# Altium schematic sheet VS1005BOB-Pico-LCD_2024-02-10.schdoc
size 572 x 342 mm
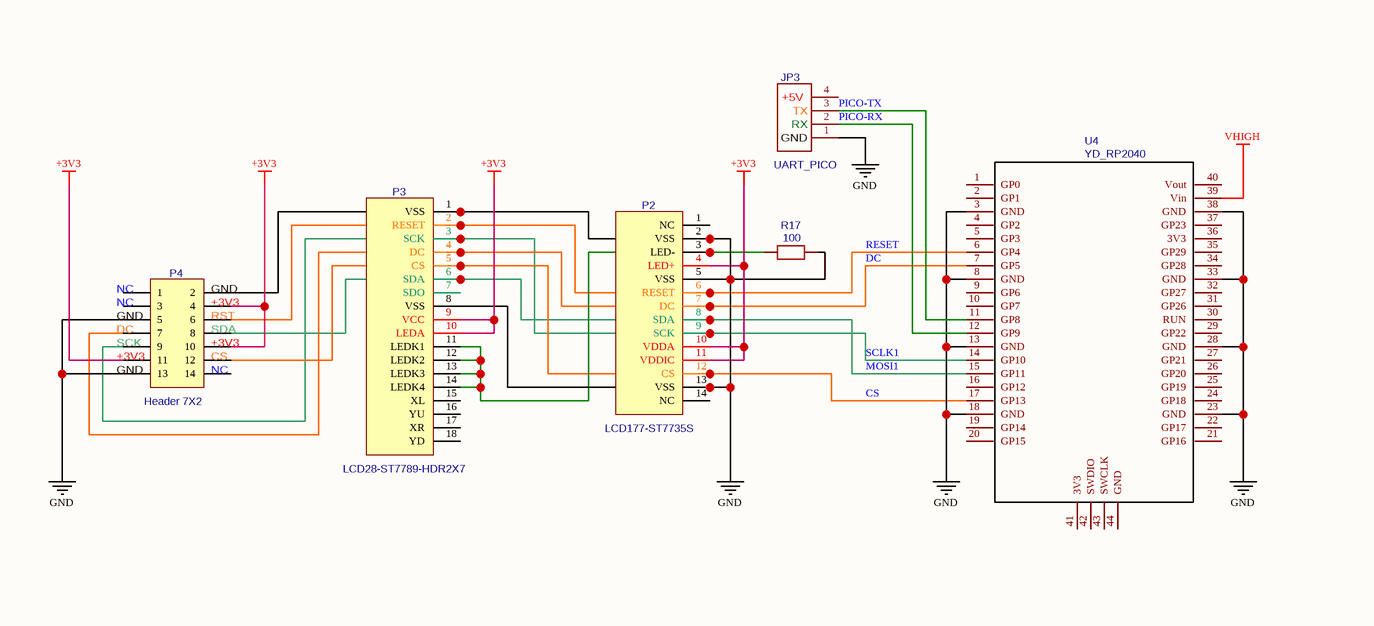
[diagram p0: VS1005BOB-Pico-LCD_2024-02-10.schdoc, left]
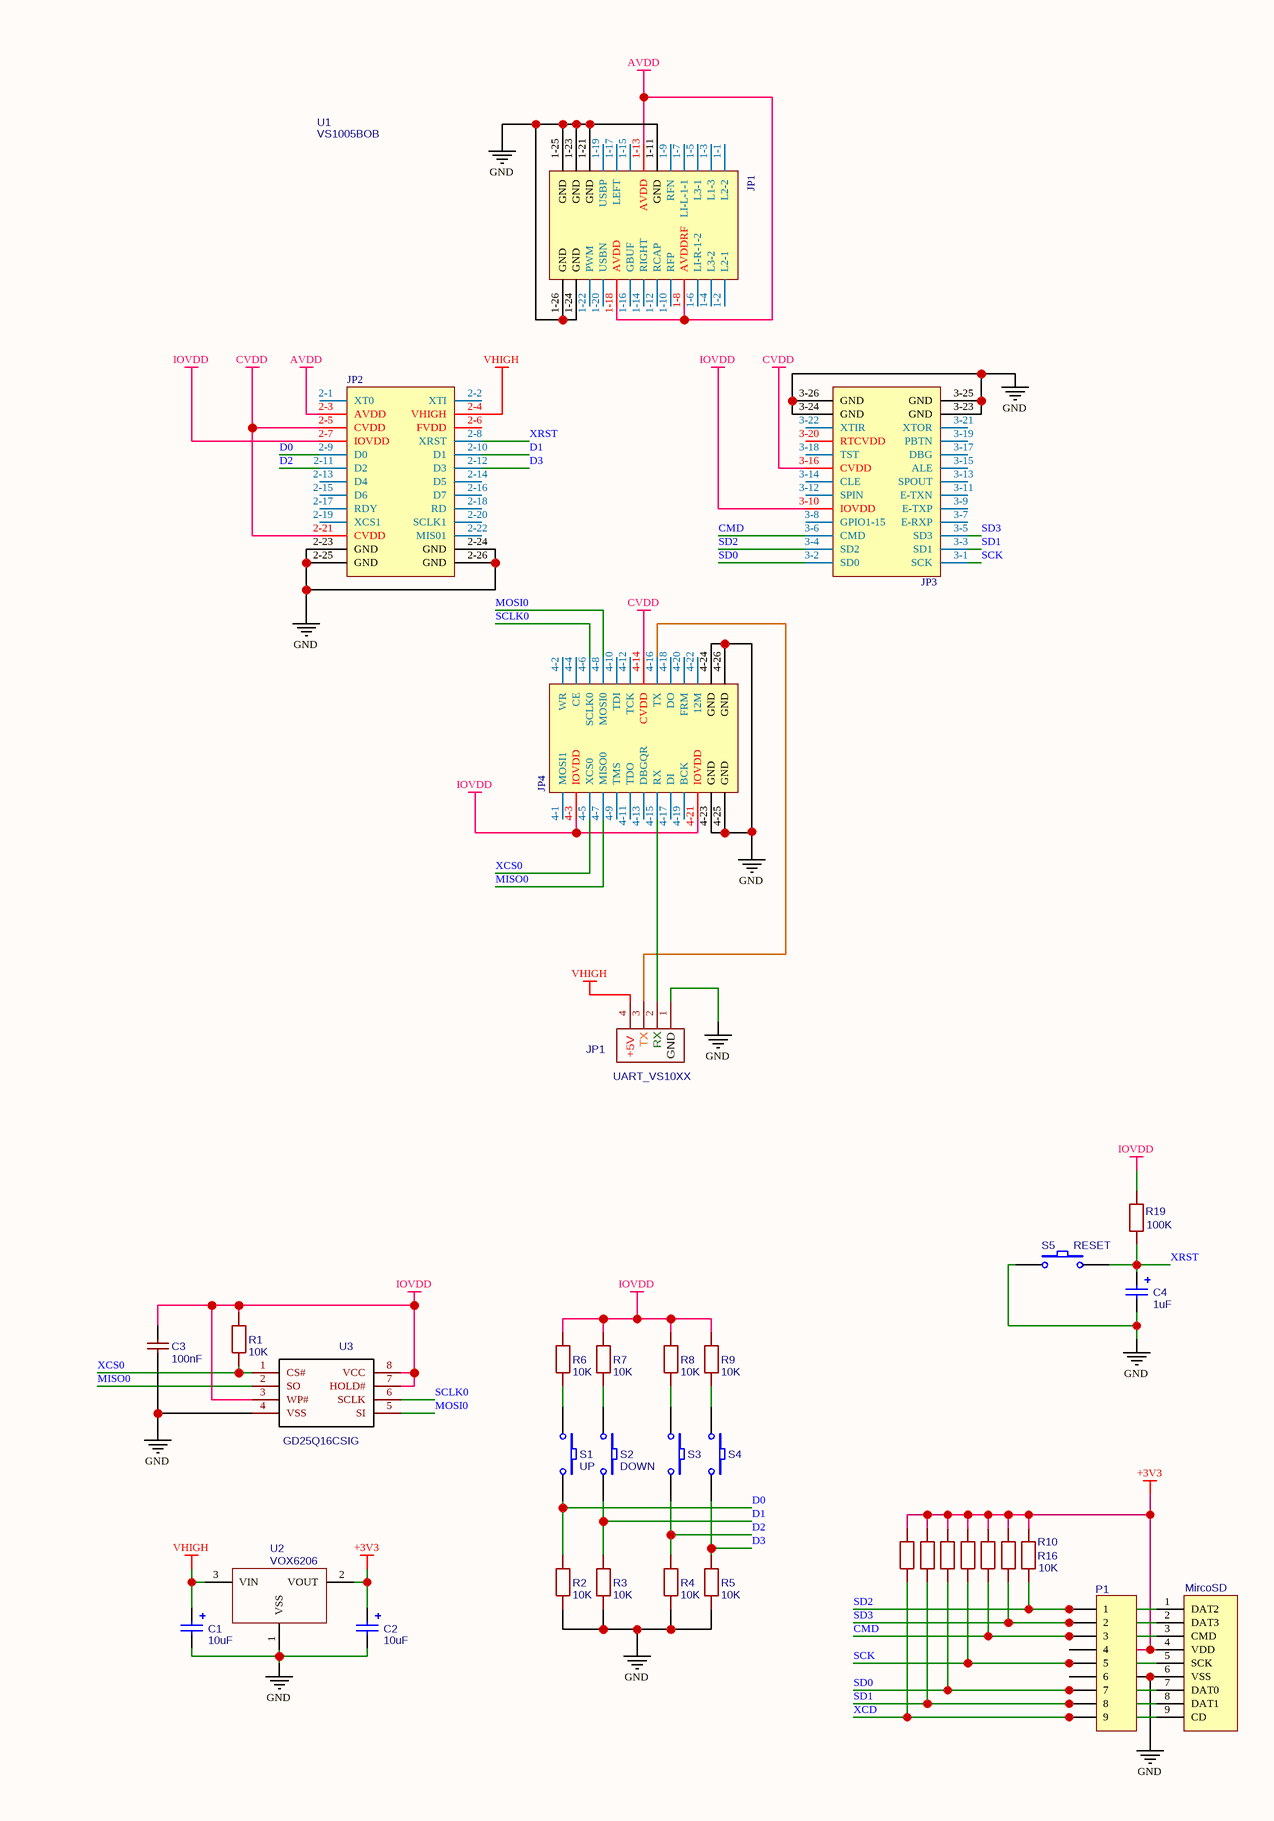
[diagram p1: VS1005BOB-Pico-LCD_2024-02-10.schdoc, right]

## Parts
C1  10uF  [CAP-DIP]
C2  10uF  [CAP-DIP]
C3  100nF  [CAP-0805]
C4  1uF  [CAP-DIP]
JP1  UART_VS10XX  [HDR1X4]
JP3  UART_PICO  [HDR1X4]
P1  Header 9  [HDR1X9]  (value not drawn)
P2  LCD177-ST7735S  [LCD177-ST7735S]
P3  LCD28-ST7789-HDR2X7  [FPC18]
P4  Header 7X2  [HDR2X7]
P6  MircoSD  [MICROSD]
R1  10K  [RES-0805]
R2  10K  [RES-0805]
R3  10K  [RES-0805]
R4  10K  [RES-0805]
R5  10K  [RES-0805]
R6  10K  [RES-0805]
R7  10K  [RES-0805]
R8  10K  [RES-0805]
R9  10K  [RES-0805]
R10  10K  [RES-0805]  (value not drawn)
R11  10K  [RES-0805]  (value not drawn)
R12  10K  [RES-0805]  (value not drawn)
R13  10K  [RES-0805]  (value not drawn)
R14  10K  [RES-0805]  (value not drawn)
R15  10K  [RES-0805]  (value not drawn)
R16  10K  [RES-0805]
R17  100  [RES-0805]
R19  100K  [RES-0805]
S1  UP  [SW-4.5]
S2  DOWN  [SW-4.5]
S3  D2  [SW-4.5]  (value not drawn)
S4  D3  [SW-4.5]  (value not drawn)
S5  RESET  [SW-4.5]
U1  VS1005BOB  [VS1005BOB]
U2  VOX6206  [VOX6206]
U3  GD25Q16CSIG  [SOIC-8_L5.3-W5.3-P1.27-LS8.0-BL]
U4  YD_RP2040  [YD-RP2040]

## Nets
+3V3: C2.1 P1.4 P2.4(LED+) P2.10(VDDA) P2.11(VDDIC) P3.9(VCC) P3.10(LEDA) P4.4 P4.10 P4.11 P6.4(VDD) R10.2 R11.2 R12.2 R13.2 R14.2 R15.2 R16.2 U2.2(VOUT)
AVDD: U1.1-8(AVDDRF) U1.1-13(AVDD) U1.1-18(AVDD) U1.2-3(AVDD)
CVDD: U1.2-5(CVDD) U1.2-21(CVDD) U1.3-16(CVDD) U1.4-14(CVDD)
GND: C1.2 C2.2 C3.2 C4.2 JP1.1 JP3.1 P1.6 P2.2(VSS) P2.5(VSS) P2.13(VSS) P3.1(VSS) P3.8(VSS) P4.2 P4.5 P4.13 P6.6(VSS) R2.1 R3.1 R4.1 R5.1 R17.1 S5.1 U1.1-11(GND) U1.1-21(GND) U1.1-23(GND) U1.1-24(GND) U1.1-25(GND) U1.1-26(GND) U1.2-23(GND) U1.2-24(GND) U1.2-25(GND) U1.2-26(GND) U1.3-23(GND) U1.3-24(GND) U1.3-25(GND) U1.3-26(GND) U1.4-23(GND) U1.4-24(GND) U1.4-25(GND) U1.4-26(GND) U2.1(VSS) U3.4(VSS) U4.3(GND) U4.8(GND) U4.13(GND) U4.18(GND) U4.23(GND) U4.28(GND) U4.33(GND) U4.38(GND)
IOVDD: C3.1 R1.2 R6.2 R7.2 R8.2 R9.2 R19.2 U1.2-7(IOVDD) U1.3-10(IOVDD) U1.4-3(IOVDD) U1.4-21(IOVDD) U3.3(WP#) U3.7(HOLD#) U3.8(VCC)
VHIGH: C1.1 JP1.4 U1.2-4(VHIGH) U2.3(VIN) U4.39(Vin)
CMD: P1.3 P6.3(CMD) R14.1 U1.3-6(CMD)
CS: P2.12(CS) P3.5(CS) P4.12 U4.17(GP13)
D0: R2.2 S1.2 U1.2-9(D0)
D1: R3.2 S2.2 U1.2-10(D1)
D2: R4.2 S3.2 U1.2-11(D2)
D3: R5.2 S4.2 U1.2-12(D3)
DC: P2.7(DC) P3.4(DC) P4.7 U4.7(GP5)
MISO0: U1.4-7(MISO0) U3.2(SO)
MOSI0: U1.4-8(MOSI0) U3.5(SI)
MOSI1: P2.8(SDA) P3.6(SDA) P4.8 U4.15(GP11)
PICO-RX: JP3.2 U4.12(GP9)
PICO-TX: JP3.3 U4.11(GP8)
RESET: P2.6(RESET) P3.2(RESET) P4.6 U4.6(GP4)
SCK: P1.5 P6.5(SCK) R13.1 U1.3-1(SCK)
SCLK0: U1.4-6(SCLK0) U3.6(SCLK)
SCLK1: P2.9(SCK) P3.3(SCK) P4.9 U4.14(GP10)
SD0: P1.7 P6.7(DAT0) R12.1 U1.3-2(SD0)
SD1: P1.8 P6.8(DAT1) R11.1 U1.3-3(SD1)
SD2: P1.1 P6.1(DAT2) R16.1 U1.3-4(SD2)
SD3: P1.2 P6.2(DAT3) R15.1 U1.3-5(SD3)
XCD: P1.9 P6.9(CD) R10.1
XCS0: R1.1 U1.4-5(XCS0) U3.1(CS#)
XRST: C4.1 R19.1 S5.2 U1.2-8(XRST)
NetJP1_2: JP1.2 U1.4-15(RX)
NetJP1_3: JP1.3 U1.4-16(TX)
NetP2_3: P2.3(LED-) P3.11(LEDK1) P3.12(LEDK2) P3.13(LEDK3) P3.14(LEDK4) R17.2
NetR6_1: R6.1 S1.1
NetR7_1: R7.1 S2.1
NetR8_1: R8.1 S3.1
NetR9_1: R9.1 S4.1

Not connected (* = marked no-connect by the designer): JP3 4; P2 1(NC) 14(NC); P3 7(SDO) 15(XL) 16(YU) 17(XR) 18(YD); P4 1 3 14; U1 1-1(L2-2) 1-2(L2-1) 1-3(L1-3) 1-4(L3-2) 1-5(L3-1) 1-6(LI-R-1-2) 1-7(LI-L-1-1) 1-9(RFN) 1-10(RFP) 1-12(RCAP) 1-14(RIGHT) 1-15 1-16(GBUF) 1-17(LEFT) 1-19(USBP) 1-20(USBN) 1-22(PWM) 2-1(XT0) 2-2(XTI) 2-6(FVDD) 2-13(D4) 2-14(D5) 2-15(D6) 2-16(D7) 2-17(RDY) 2-18(RD) 2-19(XCS1) 2-20(SCLK1) 2-22(MIS01) 3-7(E-RXP) 3-8(GPIO1-15) 3-9(E-TXP) 3-11(E-TXN) 3-12(SPIN) 3-13(SPOUT) 3-14(CLE) 3-15(ALE) 3-17(DBG) 3-18(TST) 3-19(PBTN) 3-20(RTCVDD) 3-21(XTOR) 3-22(XTIR) 4-1(MOSI1) 4-2(WR) 4-4(CE) 4-9(TMS) 4-10(TDI) 4-11(TDO) 4-12(TCK) 4-13(DBGQR) 4-17(DI) 4-18(DO) 4-19(BCK) 4-20(FRM) 4-22(12M); U4 1(GP0) 2(GP1) 4(GP2) 5(GP3) 9(GP6) 10(GP7) 16(GP12) 19(GP14) 20(GP15) 21(GP16) 22(GP17) 24(GP18) 25(GP19) 26(GP20) 27(GP21) 29(GP22) 30(RUN) 31(GP26) 32(GP27) 34(GP28) 35(GP29) 36(3V3) 37(GP23) 40(Vout) 41(3V3) 42(SWDIO) 43(SWCLK) 44(GND)

## Notes on the sheet
- (near P4) NC
- (near P4) GND
- (near P4) DC
- (near P4) SCK
- (near P4) +3V3
- (near P4) RST
- (near P4) SDA
- (near P4) CS
- (in symbol UART_PICO) +5V; TX; RX; GND
- (in symbol UART_VS10XX) TX; RX; +5V; GND
- (in symbol VS1005BOB) JP1; JP2; JP3; JP4

## Library data of the parts
C1 C2 = 10uF: Contributor: kmok163; Published: 8-Jun-2000; LatestRevisionDate: 17-Jul-2002; LatestRevisionNote: Re-released for DXP Platform.; PackageReference: RAD-0.3; Publisher: Altium Limited; spicePre: C; spiceSymbolName: 10uF
C3 = 100nF: Manufacturer Part: CC0805KRX7R9BB104; Manufacturer: YAGEO; nameAlias: Capacitance; SMT Type: Basic; Contributor: fen-1; Supplier: LCSC; LCSC Assembly: Yes; Supplier Part: C49678; spicePre: C; spiceSymbolName: CAP-0805
C4 = 1uF: Contributor: kmok163; Published: 8-Jun-2000; LatestRevisionDate: 17-Jul-2002; LatestRevisionNote: Re-released for DXP Platform.; PackageReference: RAD-0.3; Publisher: Altium Limited; spicePre: C; spiceSymbolName: 10uF
JP1 = UART_VS10XX: description: Header 4; Contributor: SparkFun; spicePre: J; spiceSymbolName: UART_VS10XX
JP3 = UART_PICO: description: Header 4; Contributor: SparkFun; spicePre: J; spiceSymbolName: UART_VS10XX
P1 = Header 9: Contributor: kmok163; LatestRevisionDate: 17-Jul-2002; LatestRevisionNote: Re-released for DXP Platform.; Publisher: Altium Limited; spicePre: P; spiceSymbolName: Header 9
P2 = LCD177-ST7735S: Contributor: kmok163; Revision: 17-Jul-2002: Re-released for DXP Platform.; Publisher: Altium Limited; spicePre: P; spiceSymbolName: LCD 1.77
P3 = LCD28-ST7789-HDR2X7: Contributor: kmok163; LatestRevisionDate: 17-Jul-2002; LatestRevisionNote: Re-released for DXP Platform.; Publisher: Altium Limited; spicePre: P; spiceSymbolName: LCD28-ST7789-HDR2X7
P4 = Header 7X2: Contributor: lingtian; LatestRevisionDate: 17-Jul-2002; LatestRevisionNote: Re-released for DXP Platform.; Publisher: Altium Limited; spicePre: P; spiceSymbolName: Header 7X2
P6 = MircoSD: Contributor: kmok163; LatestRevisionDate: 17-Jul-2002; LatestRevisionNote: Re-released for DXP Platform.; Publisher: Altium Limited; spicePre: T; spiceSymbolName: TF
R1-R16 = 10K: Contributor: EDAUSER001; spicePre: R; spiceSymbolName: RES_0805
R17 = 100: Contributor: EDAUSER001; spicePre: R; spiceSymbolName: RES_0805
R19 = 100K: Contributor: EDAUSER001; spicePre: R; spiceSymbolName: RES_0805
S1 = UP: Contributor: kmok163; Published: 24-Mar-1999; Revision: July-2002: Re-released for DXP Platform.; Publisher: Altium Limited; spicePre: S; spiceSymbolName: reset
S2 = DOWN: Contributor: kmok163; Published: 24-Mar-1999; Revision: July-2002: Re-released for DXP Platform.; Publisher: Altium Limited; spicePre: S; spiceSymbolName: reset
S3 = D2: Contributor: kmok163; Published: 24-Mar-1999; Revision: July-2002: Re-released for DXP Platform.; Publisher: Altium Limited; spicePre: S; spiceSymbolName: reset
S4 = D3: Contributor: kmok163; Published: 24-Mar-1999; Revision: July-2002: Re-released for DXP Platform.; Publisher: Altium Limited; spicePre: S; spiceSymbolName: reset
S5 = RESET: Contributor: kmok163; Published: 24-Mar-1999; Revision: July-2002: Re-released for DXP Platform.; Publisher: Altium Limited; spicePre: S; spiceSymbolName: reset
U1 = VS1005BOB: Manufacturer: VLSI Solution Oy; Contributor: kmok163; spicePre: U; spiceSymbolName: VS1005BOB; Manufacturer Part: VS1005BOB
U2 = VOX6206: Contributor: kmok163; Published: 8-Jun-2000; Publisher: Altium Limited; LatestRevisionDate: 15-Jan-2003; LatestRevisionNote: PCB Footprint 'BCY-W3/D4.7' replaced; DatasheetDocument: 1997; PackageDocument: Sep-1998; PackageReference: TO-92A; Code_JEDEC: TO-92A; ComponentLink1Description: Manufacturer Link; ComponentLink1URL: http://www.fairchildsemi.com/; ComponentLink2Description: Datasheet; ComponentLink2URL: http://www.fairchildsemi.com/ds/2N%2F2N3904.pdf; spicePre: I; spiceSymbolName: VOX6206
U3 = GD25Q16CSIG: Manufacturer: GigaDevice(兆易创新); Supplier: LCSC; Manufacturer Part: GD25Q16CSIG; Supplier Part: C79074; JLCPCB Part Class: Extended Part; spicePre: U; spiceSymbolName: GD25Q16CSIG
U4 = YD_RP2040: Contributor: armxu; spicePre: U; spiceSymbolName: YD_RP2040